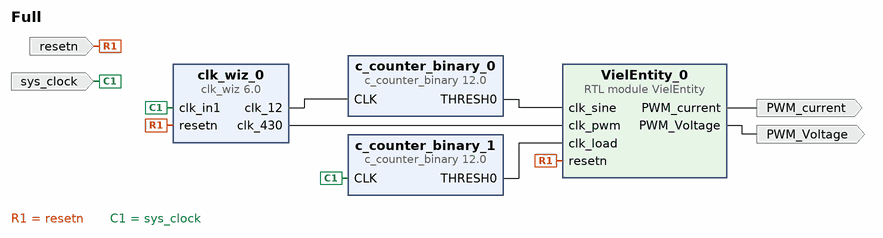
[diagram p0: block diagram of the top level]
# Vivado block design Full, xc7a35ticsg324-1L, Vivado 2018.2
create_bd_design Full

create_bd_port -dir I -type clk sys_clock
set_property -dict {CONFIG.FREQ_HZ 100000000 CONFIG.PHASE 0.000} [get_bd_ports sys_clock]
create_bd_port -dir I -type rst resetn
create_bd_port -dir O PWM_current
create_bd_port -dir O PWM_Voltage

create_bd_cell -type ip -vlnv xilinx.com:ip:clk_wiz:6.0 clk_wiz_0
set_property -dict [list \
  CONFIG.PRIMITIVE PLL \
  CONFIG.CLKOUT2_USED true \
  CONFIG.NUM_OUT_CLKS 2 \
  CONFIG.CLK_OUT1_PORT clk_12 \
  CONFIG.CLK_OUT2_PORT clk_430 \
  CONFIG.CLKOUT1_REQUESTED_OUT_FREQ 12 \
  CONFIG.CLKOUT2_REQUESTED_OUT_FREQ 430 \
  CONFIG.CLKOUT1_DRIVES BUFG \
  CONFIG.CLKOUT2_DRIVES BUFG \
  CONFIG.CLKOUT3_DRIVES BUFG \
  CONFIG.CLKOUT4_DRIVES BUFG \
  CONFIG.CLKOUT5_DRIVES BUFG \
  CONFIG.CLKOUT6_DRIVES BUFG \
  CONFIG.CLKOUT7_DRIVES BUFG \
  CONFIG.USE_LOCKED false \
  CONFIG.RESET_PORT resetn \
  CONFIG.MMCM_DIVCLK_DIVIDE 1 \
  CONFIG.MMCM_CLKFBOUT_MULT_F 13 \
  CONFIG.MMCM_COMPENSATION ZHOLD \
  CONFIG.MMCM_CLKOUT0_DIVIDE_F 108 \
  CONFIG.MMCM_CLKOUT1_DIVIDE 3 \
  CONFIG.RESET_TYPE ACTIVE_LOW \
  CONFIG.USE_BOARD_FLOW true \
  CONFIG.CLK_IN1_BOARD_INTERFACE sys_clock \
  CONFIG.CLKOUT1_JITTER 172.617 \
  CONFIG.CLKOUT1_PHASE_ERROR 82.897 \
  CONFIG.CLKOUT2_JITTER 84.092 \
  CONFIG.CLKOUT2_PHASE_ERROR 82.897 \
] [get_bd_cells clk_wiz_0]
create_bd_cell -type ip -vlnv xilinx.com:ip:c_counter_binary:12.0 c_counter_binary_0
set_property -dict [list \
  CONFIG.Output_Width 11 \
  CONFIG.Restrict_Count true \
  CONFIG.Final_Count_Value 7D0 \
  CONFIG.Sync_Threshold_Output true \
  CONFIG.Threshold_Value 7D0 \
] [get_bd_cells c_counter_binary_0]
create_bd_cell -type ip -vlnv xilinx.com:ip:c_counter_binary:12.0 c_counter_binary_1
set_property -dict [list \
  CONFIG.Output_Width 14 \
  CONFIG.Increment_Value 1 \
  CONFIG.Restrict_Count true \
  CONFIG.Final_Count_Value 2710 \
  CONFIG.Sync_Threshold_Output true \
  CONFIG.Threshold_Value 2710 \
] [get_bd_cells c_counter_binary_1]
create_bd_cell -type module -reference VielEntity VielEntity_0

# ---- connections ----

connect_bd_net [get_bd_ports resetn] [get_bd_pins clk_wiz_0/resetn] [get_bd_pins VielEntity_0/resetn]
connect_bd_net [get_bd_pins clk_wiz_0/clk_430] [get_bd_pins VielEntity_0/clk_pwm]
connect_bd_net [get_bd_pins VielEntity_0/PWM_current] [get_bd_ports PWM_current]
connect_bd_net [get_bd_pins VielEntity_0/PWM_Voltage] [get_bd_ports PWM_Voltage]
connect_bd_net [get_bd_ports sys_clock] [get_bd_pins clk_wiz_0/clk_in1] [get_bd_pins c_counter_binary_1/CLK]
connect_bd_net [get_bd_pins clk_wiz_0/clk_12] [get_bd_pins c_counter_binary_0/CLK]
connect_bd_net [get_bd_pins c_counter_binary_0/THRESH0] [get_bd_pins VielEntity_0/clk_sine]
connect_bd_net [get_bd_pins c_counter_binary_1/THRESH0] [get_bd_pins VielEntity_0/clk_load]

validate_bd_design
save_bd_design
